# EAGLE schematic micro_board (EAGLE 6.2)
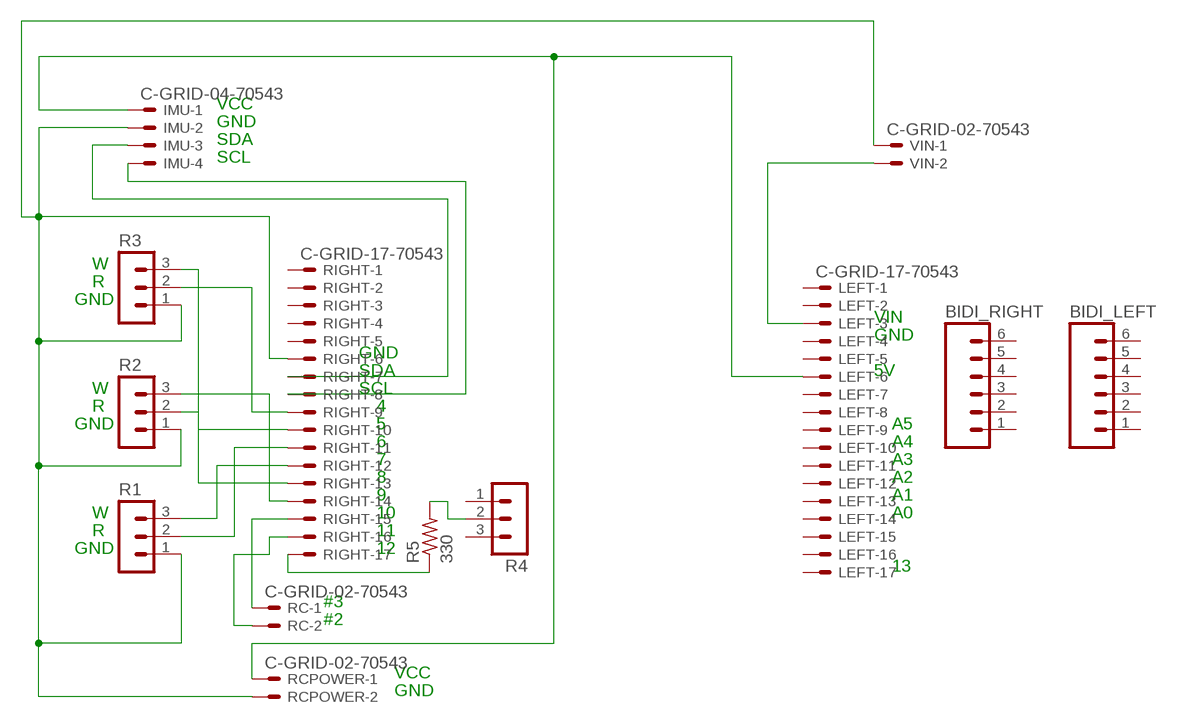
[diagram p0: schematic, sheet 1]

## Parts
BIDI_LEFT  M06LONGPADS  [1X06_LONGPADS]
BIDI_RIGHT  M06LONGPADS  [1X06_LONGPADS]
IMU  C-GRID-04-70543  [70543-04]
LEFT  C-GRID-17-70543  [70543-17]
R1  MA03-1  [MA03-1]
R2  MA03-1  [MA03-1]
R3  MA03-1  [MA03-1]
R4  MA03-1  [MA03-1]
R5  330  R-US_0207/12  [0207/12]
RC  C-GRID-02-70543  [70543-02]
RCPOWER  C-GRID-02-70543  [70543-02]
RIGHT  C-GRID-17-70543  [70543-17]
VIN  C-GRID-02-70543  [70543-02]

## Nets
5V: IMU.1 LEFT.6 RCPOWER.1
GND: IMU.2 R1.1 R2.1 R3.1 RCPOWER.2 RIGHT.6 VIN.1
N$1: R3.2 RIGHT.9
N$2: R2.2 RIGHT.10
N$3: R1.2 RIGHT.11
N$4: R1.3 RIGHT.12
N$5: R3.3 RIGHT.13
N$6: R2.3 RIGHT.14
N$7: IMU.3 RIGHT.7
N$8: IMU.4 RIGHT.8
N$9: RC.1 RIGHT.15
N$10: RC.2 RIGHT.16
N$11: R5.1 RIGHT.17
N$12: R4.2 R5.2
N$13: LEFT.3 VIN.2
Unconnected: BIDI_LEFT.1 BIDI_LEFT.2 BIDI_LEFT.3 BIDI_LEFT.4 BIDI_LEFT.5 BIDI_LEFT.6 BIDI_RIGHT.1 BIDI_RIGHT.2 BIDI_RIGHT.3 BIDI_RIGHT.4 BIDI_RIGHT.5 BIDI_RIGHT.6 LEFT.1 LEFT.2 LEFT.4 LEFT.5 LEFT.7 LEFT.8 LEFT.9 LEFT.10 LEFT.11 LEFT.12 LEFT.13 LEFT.14 LEFT.15 LEFT.16 LEFT.17 R4.1 R4.3 RIGHT.1 RIGHT.2 RIGHT.3 RIGHT.4 RIGHT.5

## Notes on the sheet
- VCC
- GND
- SDA
- SCL
- W
- R
- GND
- VIN
- GND
- GND
- SDA | 5V
- W | SCL
- R | 4
- GND | 5 | A5
- 6 | A4
- 7 | A3
- 8 | A2
- 9 | A1
- W | 10 | A0
- R | 11
- GND | 12
- 13
- #3
- #2
- VCC
- GND

## Library data of the parts
BIDI_LEFT BIDI_RIGHT = SparkFun:M06: Header 6 Standard 6-pin 0.1" header. Use with straight break away headers (SKU : PRT-00116), right angle break away headers (PRT-00553), swiss pins (PRT-00743), machine pins (PRT-00117), and female headers (PRT-00115). Molex polarized connector foot print use with SKU : PRT-08094 with associated crimp pins and housings. NOTES ON THE VARIANTS LOCK and LOCK_LONGPADS... This footprint was designed to help hold the alignment of a through-hole component (i.e. 6-pin header) while soldering it into place. You may notice that each hole has been shifted either up or down by 0.005 of an inch from it's more standard position (which is a perfectly straight line). This slight alteration caused the pins (the squares in the middle) to touch the edges of the holes. Because they are alternating, it causes a "brace" to hold the component in place. 0.005 has proven to be the perfect amount of "off-center" position when using our standard breakaway headers. Although looks a little odd when you look at the bare footprint, once you have a header in there, the alteration is very hard to notice. Also, if you push a header all the way into place, it is covered up entirely on the bottom side. This idea of altering the position of holes to aid alignment will be further integrated into the Sparkfun Library for other footprints. It can help hold any component with 3 or more connection pins.
IMU = con-molex:C-GRID-04: CONNECTOR wire to board 2.54 mm (0.100") pitch header; OC_FARNELL: unknown; OC_NEWARK: unknown
LEFT RIGHT = con-molex:C-GRID-17: CONNECTOR wire to board 2.54 mm (0.100") pitch header; OC_FARNELL: unknown; OC_NEWARK: unknown
R1-R4 = con-lstb:MA03-1: PIN HEADER; OC_FARNELL: unknown; OC_NEWARK: unknown
R5 = resistor:R-US_: RESISTOR, American symbol
RC RCPOWER VIN = con-molex:C-GRID-02: CONNECTOR wire to board 2.54 mm (0.100") pitch header; OC_FARNELL: unknown; OC_NEWARK: unknown